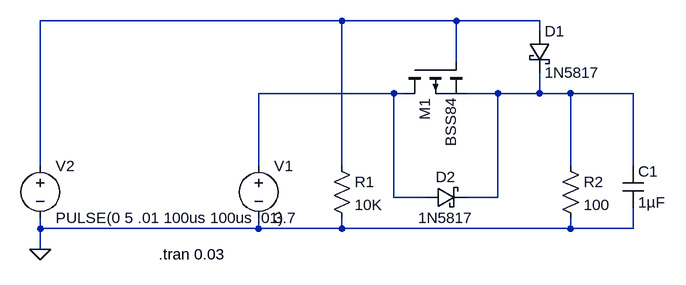
[diagram p0: schematic MOSFET.asc]
MOSFET.asc, the LTspice schematic file:
Version 4
SHEET 1 880 680
WIRE 176 -48 -288 -48
WIRE 352 -48 176 -48
WIRE 480 -48 352 -48
WIRE 480 -32 480 -48
WIRE 352 16 352 -48
WIRE 256 64 48 64
WIRE 272 64 256 64
WIRE 416 64 368 64
WIRE 480 64 480 32
WIRE 480 64 416 64
WIRE 528 64 480 64
WIRE 624 64 528 64
WIRE -288 176 -288 -48
WIRE 48 176 48 64
WIRE 176 176 176 -48
WIRE 528 176 528 64
WIRE 624 176 624 64
WIRE 256 224 256 64
WIRE 304 224 256 224
WIRE 416 224 416 64
WIRE 416 224 368 224
WIRE -288 272 -288 256
WIRE 48 272 48 256
WIRE 48 272 -288 272
WIRE 176 272 176 256
WIRE 176 272 48 272
WIRE 528 272 528 256
WIRE 528 272 176 272
WIRE 624 272 624 240
WIRE 624 272 528 272
WIRE -288 304 -288 272
FLAG -288 304 0
SYMBOL voltage 48 160 R0
WINDOW 123 0 0 Left 2
WINDOW 39 0 0 Left 2
SYMATTR InstName V1
SYMATTR Value 3.7
SYMBOL voltage -288 160 R0
WINDOW 123 0 0 Left 2
WINDOW 39 0 0 Left 2
SYMATTR InstName V2
SYMATTR Value PULSE(0 5 .01 100us 100us .01)
SYMBOL pmos 272 16 M90
SYMATTR InstName M1
SYMATTR Value BSS84
SYMBOL res 160 160 R0
SYMATTR InstName R1
SYMATTR Value 10K
SYMBOL schottky 464 -32 R0
SYMATTR InstName D1
SYMATTR Value 1N5817
SYMATTR Description Diode
SYMATTR Type diode
SYMBOL res 512 160 R0
SYMATTR InstName R2
SYMATTR Value 100
SYMBOL cap 608 176 R0
SYMATTR InstName C1
SYMATTR Value 1µF
SYMBOL schottky 304 240 R270
WINDOW 0 32 32 VTop 2
WINDOW 3 0 32 VBottom 2
SYMATTR InstName D2
SYMATTR Value 1N5817
SYMATTR Description Diode
SYMATTR Type diode
TEXT -106 312 Left 2 !.tran 0.03

The netlist it stands for:
* MOSFET.asc
V1 N002 0 3.7
V2 N001 0 PULSE(0 5 .01 100us 100us .01)
M1 N002 N001 N003 N003 BSS84
R1 N001 0 10K
D1 N001 N003 1N5817
R2 N003 0 100
C1 N003 0 1µF
D2 N002 N003 1N5817
.model D D
.lib standard.dio
.model NMOS NMOS
.model PMOS PMOS
.lib standard.mos
.tran 0.03
.backanno
.end